# EAGLE schematic xformer (EAGLE 8.4.2)
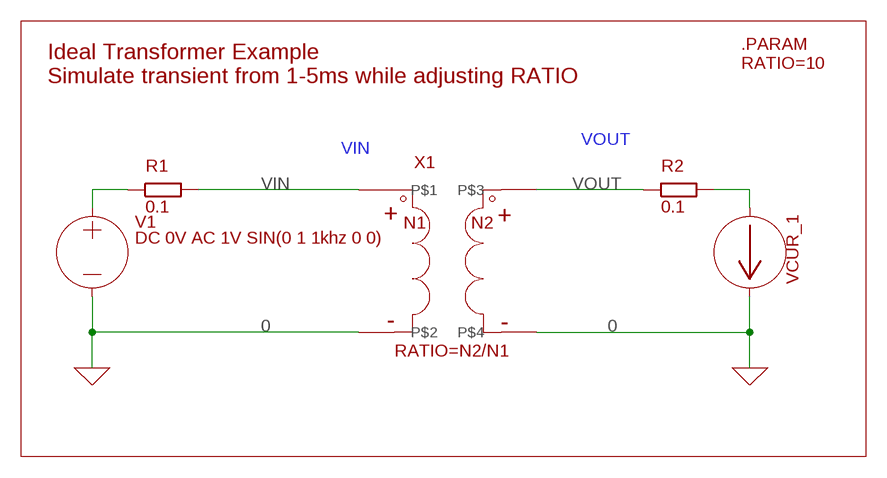
[diagram p0: schematic, sheet 1]

## Parts
R1  0.1  R  (no package)
R2  0.1  R  (no package)
V1  DC 0V AC 1V SIN(0 1 1khz 0 0)  VOLTAGE  (no package)
VCUR_1  0V  AMMETER  (no package)
X1  TRANSFORMER  (no package)

## Nets
0: V1.- VCUR_1.- X1.P$2 X1.P$4 ; supply symbol labelled GND
N$2: R1.1 V1.+
N$4: R2.2 VCUR_1.+
VIN: R1.2 X1.P$1
VOUT: R2.1 X1.P$3

## Notes on the sheet
- .PARAM
  RATIO=10
- Ideal Transformer Example
  Simulate transient from 1-5ms while adjusting RATIO

## Library data of the parts
R1 R2 = ngspice-simulation:R: RESISTOR
V1 = ngspice-simulation:VOLTAGE: Independent Voltage Source, either DC, AC, PULSE, SINE, PWL, EXP, or SFFM; VALUE: 0V
VCUR_1 = ngspice-simulation:AMMETER: AMMETER
X1 = ngspice-simulation:TRANSFORMER: Coupled inductors